# EasyEDA schematic LcsNodes-Ext-Dual-Power-Module-L6205-A.01.00.json
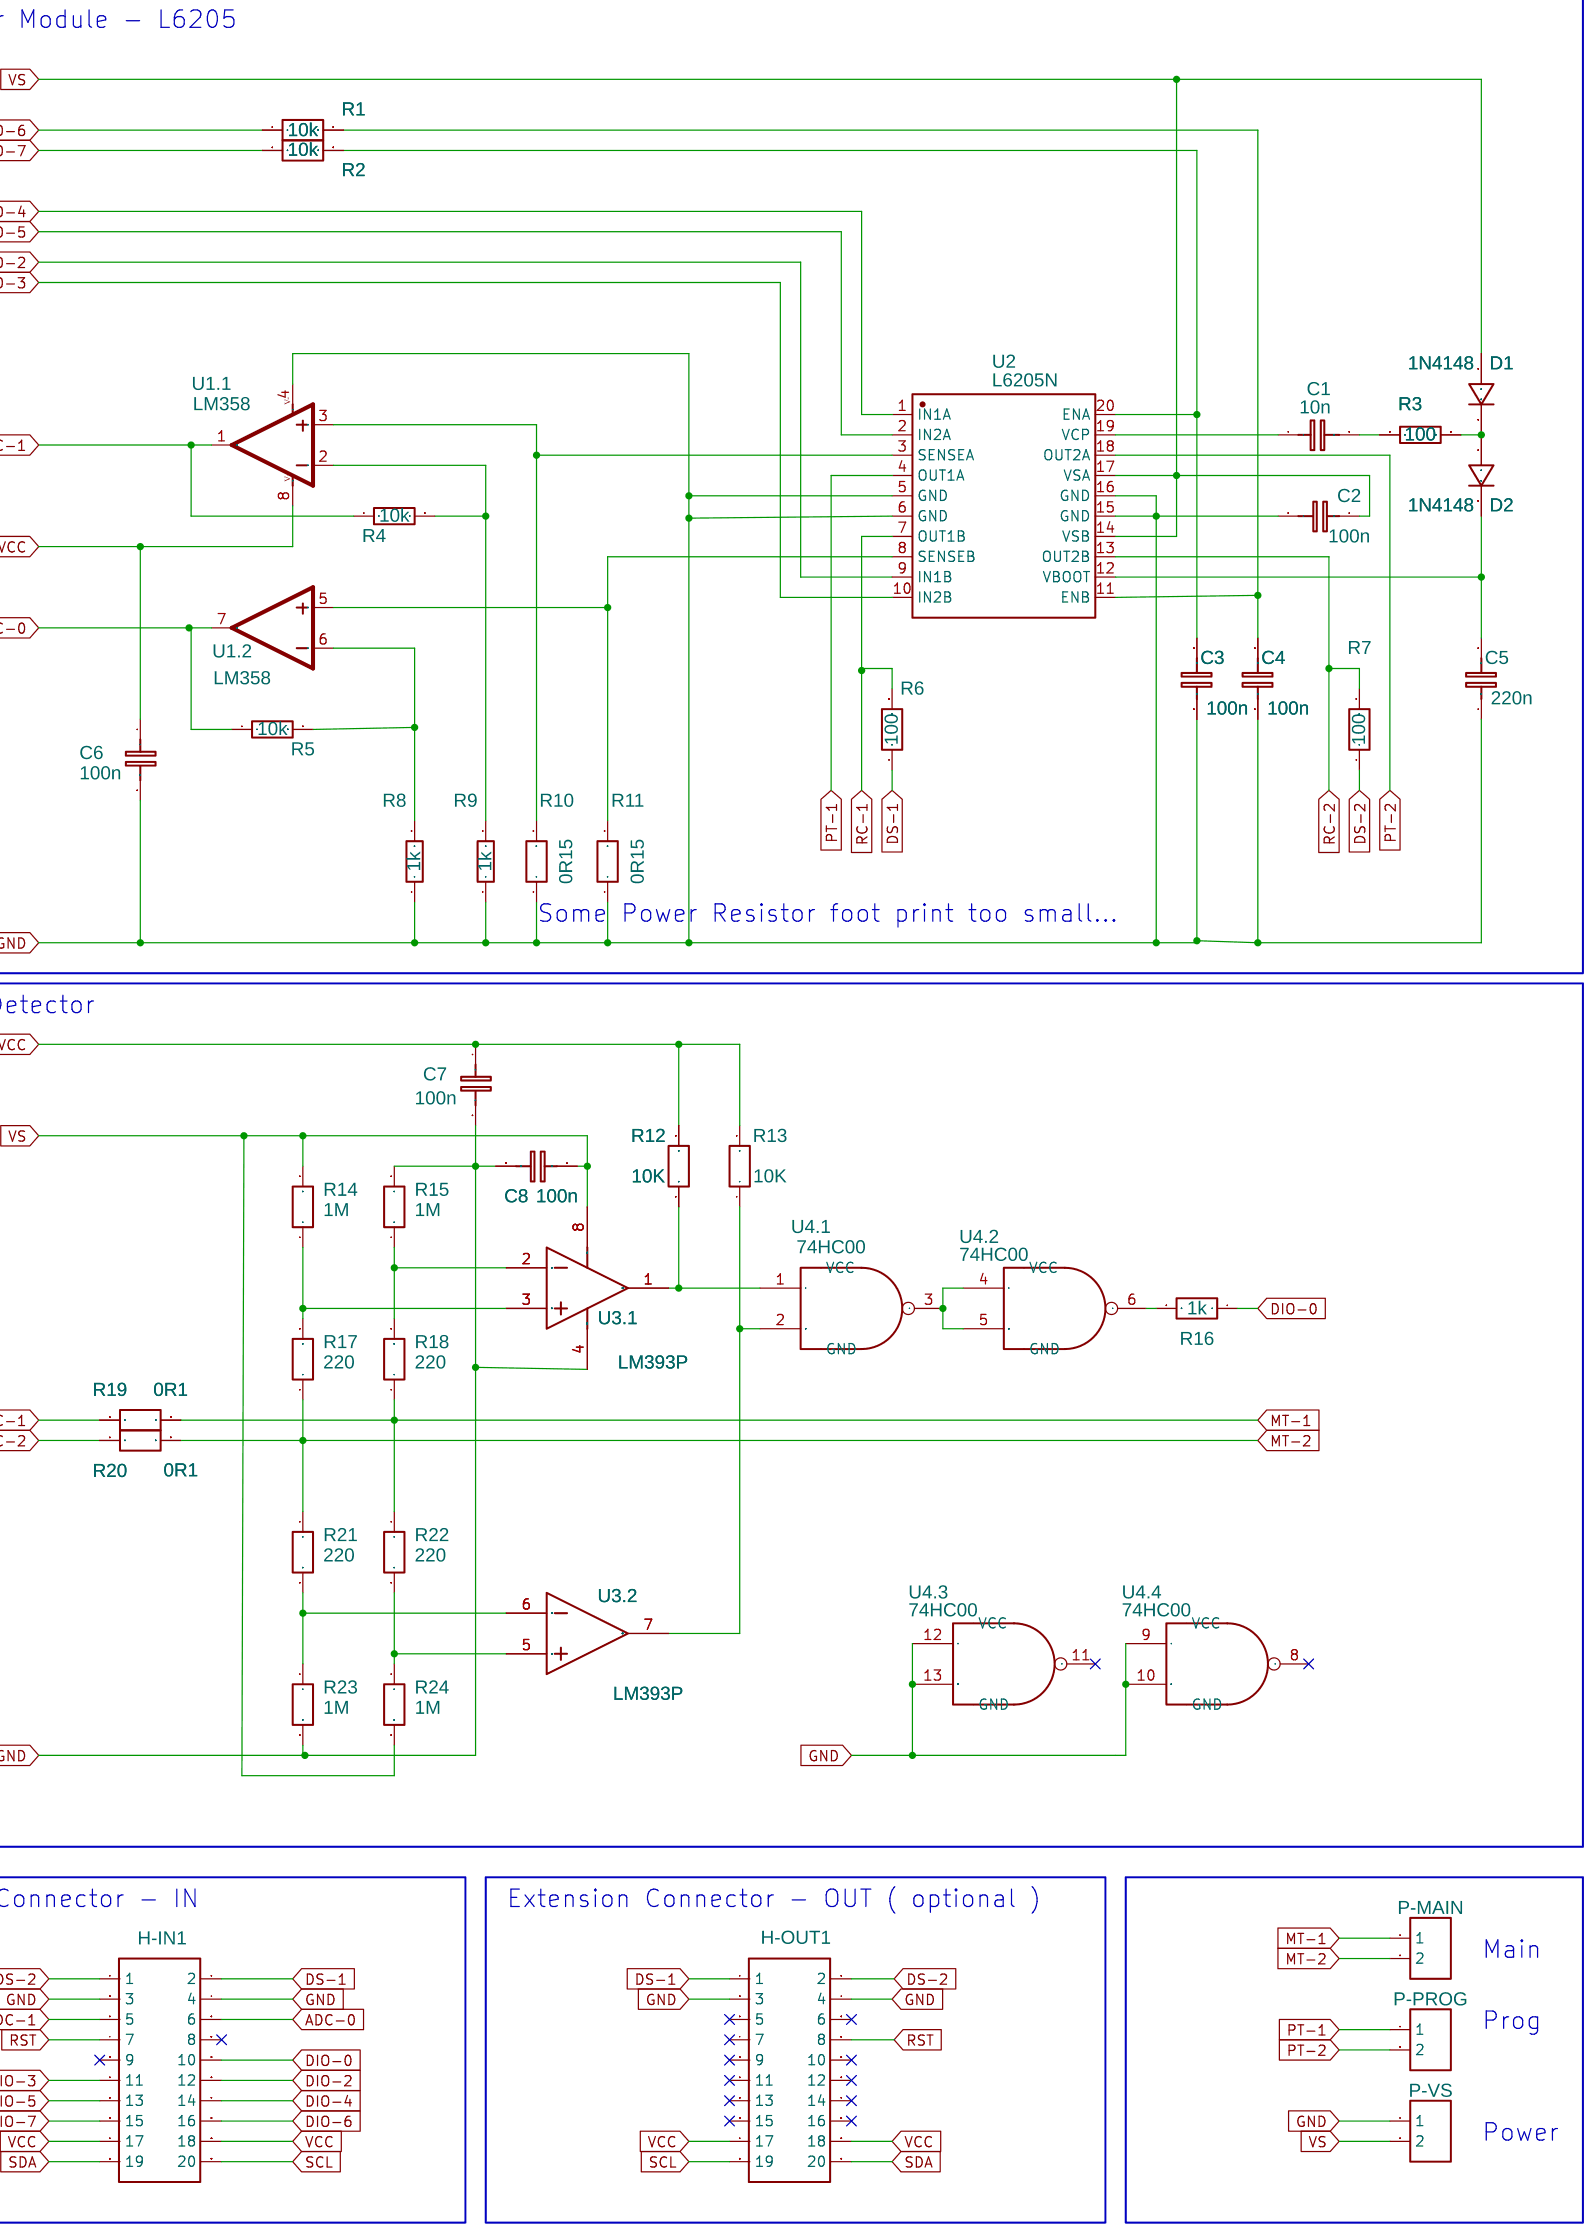
[diagram p0: schematic sheet]

## Parts
C1  10n  [RAD-0.1]
C2  100n  [RAD-0.1]
C3  100n  [RAD-0.1]
C4  100n  [RAD-0.1]
C5  220n  [RAD-0.1]
C6  100n  [RAD-0.1]
C7  100n  [RAD-0.1]
C8  100n  [RAD-0.1]
D1  1N4148  [DO-35_BD2.0-L4.0-P8.00-D0.5-FD]
D2  1N4148  [DO-35_BD2.0-L4.0-P8.00-D0.5-FD]
H-IN1  HDR-F-2.54_2x10  [HDR-F-2.54_2X10]
H-OUT1  HDR-F-2.54_2x10  [HDR-F-2.54_2X10]
P-MAIN  CONN-TH_2P-P5.08  [CONN-TH_2P-P5.08]
P-PROG  CONN-TH_2P-P5.08  [CONN-TH_2P-P5.08]
P-VS  CONN-TH_2P-P5.08  [CONN-TH_2P-P5.08]
R1  10k  [R_AXIAL-0.3]
R2  10k  [R_AXIAL-0.3]
R3  100  [R_AXIAL-0.3]
R4  10k  [R_AXIAL-0.3]
R5  10k  [R_AXIAL-0.3]
R6  100  [R_AXIAL-0.3]
R7  100  [R_AXIAL-0.3]
R8  1k  [R_AXIAL-0.3]
R9  1k  [R_AXIAL-0.3]
R10  0R15  [R_AXIAL-0.6]
R11  0R15  [R_AXIAL-0.6]
R12  10K  [R_AXIAL-0.3]
R13  10K  [R_AXIAL-0.3]
R14  1M  [R_AXIAL-0.3]
R15  1M  [R_AXIAL-0.3]
R16  1k  [R_AXIAL-0.3]
R17  220  [R_AXIAL-0.3]
R18  220  [R_AXIAL-0.3]
R19  0R1  [R_AXIAL-0.6]
R20  0R1  [R_AXIAL-0.6]
R21  220  [R_AXIAL-0.3]
R22  220  [R_AXIAL-0.3]
R23  1M  [R_AXIAL-0.3]
R24  1M  [R_AXIAL-0.3]
U1  LM358  [DIP-8_L10.1-W6.3-P2.54-LS7.6-BL]  (sections 1,2)
U2  L6205N  [PDIP-20_L24.5-W7.3-P2.54-LS7.9-BL]
U3  LM393P  [DIP-8_L10.1-W6.3-P2.54-LS7.6-BL]  (sections 1,2)
U4  74HC00  [PDIP-14_L19.2-W6.4-P2.54-LS8.0-BL]  (sections 1,2,3,4)

## Library data of the parts
C1-C5 = C_0603_EU: Contributor: LCEDA_Lib
C6-C8 = C_0603_EU: Contributor: LCEDA_Lib; Package Display: No
D1 D2 = 1N4148: Supplier: LCSC; Manufacturer: SEMTECH; Supplier Part: C14516; Contributor: LCEDA_Lib
H-IN1 H-OUT1 = HDR-F-2.54_2x10: Supplier Part: C30867; Supplier: LCSC; Contributor: LCEDA_Lib
P-MAIN P-PROG P-VS = CONN-TH_2P-P5.08: Supplier: LCSC; Contributor: LCEDA_Lib
R1 R2 R6 R7 R12-R24 = R_AXIAL-0.3_EU: Contributor: LCEDA_Lib
R3-R5 R8 R9 = RESISTOR-AXIAL-0.1
R10 R11 = R_AXIAL-0.5_EU: Contributor: LCEDA_Lib
U1 = LM358: Contributor: SparkFun; subpart_no: 1
U2 = L6205N: Supplier: LCSC; Supplier Part: C962260; Manufacturer: STMicroelectronics; Contributor: LCSC
U3 = LM393P: Supplier: LCSC; Manufacturer: TI; image: //image.lceda.cn/szlcsc/C5209.jpg; Supplier Part: C5209; subpart_no: 1
U4 = 74HC00: Contributor: David EL; subpart_no: 1

## Nets
GND: C2.2 C3.1 C4.1 C5.1 C6.2 C7.2 C8.2 H-IN1.3 H-IN1.4 H-OUT1.3 H-OUT1.4 P-VS.1 R8.1 R9.1 R10.1 R11.1 R15.2 R23.2 U1.4(V-) U2.5(GND) U2.6(GND) U2.15(GND) U2.16(GND) U3.4(GND) U4.9(A) U4.10(B) U4.12(A) U4.13(B)
VCC: C6.1 C7.1 H-IN1.17 H-IN1.18 H-OUT1.17 H-OUT1.18 R12.2 R13.2 U1.8(V+)
ADC-0: H-IN1.6 R5.1 U1.7(OUT)
ADC-1: H-IN1.5 R4.1 U1.1(OUT)
DIO-0: H-IN1.10 R16.1
DIO-2: H-IN1.12 U2.9(IN1B)
DIO-3: H-IN1.11 U2.10(IN2B)
DIO-4: H-IN1.14 U2.1(IN1A)
DIO-5: H-IN1.13 U2.2(IN2A)
DIO-6: H-IN1.16 R1.1
DIO-7: H-IN1.15 R2.1
DS-1: H-IN1.2 H-OUT1.1 R6.1
DS-2: H-IN1.1 H-OUT1.2 R7.1
MT-1: P-MAIN.1 R18.1 R19.2 R22.1
MT-2: P-MAIN.2 R17.1 R20.2 R21.1
PT-1: P-PROG.1 U2.4(OUT1A)
PT-2: P-PROG.2 U2.18(OUT2A)
RC-1: R6.2 R19.1 U2.7(OUT1B)
RC-2: R7.2 R20.1 U2.13(OUT2B)
RST: H-IN1.7 H-OUT1.8
SCL: H-IN1.20 H-OUT1.19
SDA: H-IN1.19 H-OUT1.20
VS: C2.1 C8.1 D1.1 P-VS.2 R14.2 R24.2 U2.14(VSB) U2.17(VSA) U3.8(VCC)
Net-(C1-1): C1.1 U2.19(VCP)
Net-(C1-2): C1.2 R3.1
Net-(C3-2): C3.2 R2.2 U2.20(ENA)
Net-(C4-2): C4.2 R1.2 U2.11(ENB)
Net-(C5-2): C5.2 D2.2 U2.12(VBOOT)
Net-(D1-2): D1.2 D2.1 R3.2
Net-(R4-2): R4.2 R9.2 U1.2(-IN)
Net-(R5-2): R5.2 R8.2 U1.6(-IN)
Net-(R10-2): R10.2 U1.3(+IN) U2.3(SENSEA)
Net-(R11-2): R11.2 U1.5(+IN) U2.8(SENSEB)
Net-(R12-1): R12.1 U3.1(1OUT) U4.1(A)
Net-(R13-1): R13.1 U3.7(2OUT) U4.2(B)
Net-(R14-1): R14.1 R17.2 U3.3(1IN+)
Net-(R15-1): R15.1 R18.2 U3.2(1IN-)
Net-(R16-2): R16.2 U4.6(Y)
Net-(R21-2): R21.2 R23.1 U3.6(2IN-)
Net-(R22-2): R22.2 R24.1 U3.5(2IN+)
Net-(U4.1-3): U4.3(Y) U4.4(A) U4.5(B)

Not connected (* = marked no-connect by the designer): H-IN1 8* 9*; H-OUT1 5* 6* 7* 9* 10* 11* 12* 13* 14* 15* 16*; U4 7(GND) 8(Y)* 11(Y)* 14(VCC)

## Notes on the sheet
- LcsNodes-Extension-Dual-Power-Module-L6205-A.00.01
- Dual Power Module - L6205
- Some Power Resistor foot print too small...
- RailCom Detector
- Extension Connector - IN
- Extension Connector - OUT ( optional )
- Main
- Prog
- Power
